# Altium schematic sheet Gateway.SchDoc
size A
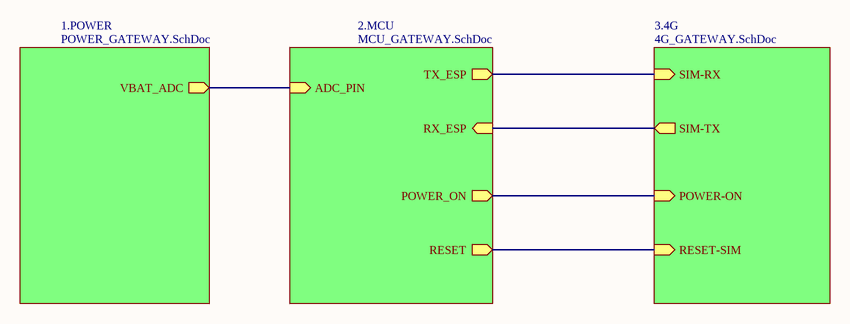
[diagram p0: Gateway.SchDoc]

## Sub-sheets
1.POWER = POWER_GATEWAY.SchDoc: VBAT_ADC (out)
2.MCU = MCU_GATEWAY.SchDoc: ADC_PIN (in), TX_ESP (out), RX_ESP (in), POWER_ON (out), RESET (out)
3.4G = 4G_GATEWAY.SchDoc: SIM-RX (in), SIM-TX (out), POWER-ON (in), RESET-SIM (in)

## Nets
(unnamed): sheet 1.POWER/VBAT_ADC, sheet 2.MCU/ADC_PIN
(unnamed): sheet 2.MCU/TX_ESP, sheet 3.4G/SIM-RX
(unnamed): sheet 2.MCU/RX_ESP, sheet 3.4G/SIM-TX
(unnamed): sheet 2.MCU/POWER_ON, sheet 3.4G/POWER-ON
(unnamed): sheet 2.MCU/RESET, sheet 3.4G/RESET-SIM